# EAGLE design ThingShield_Proto (EAGLE 6.6.0)
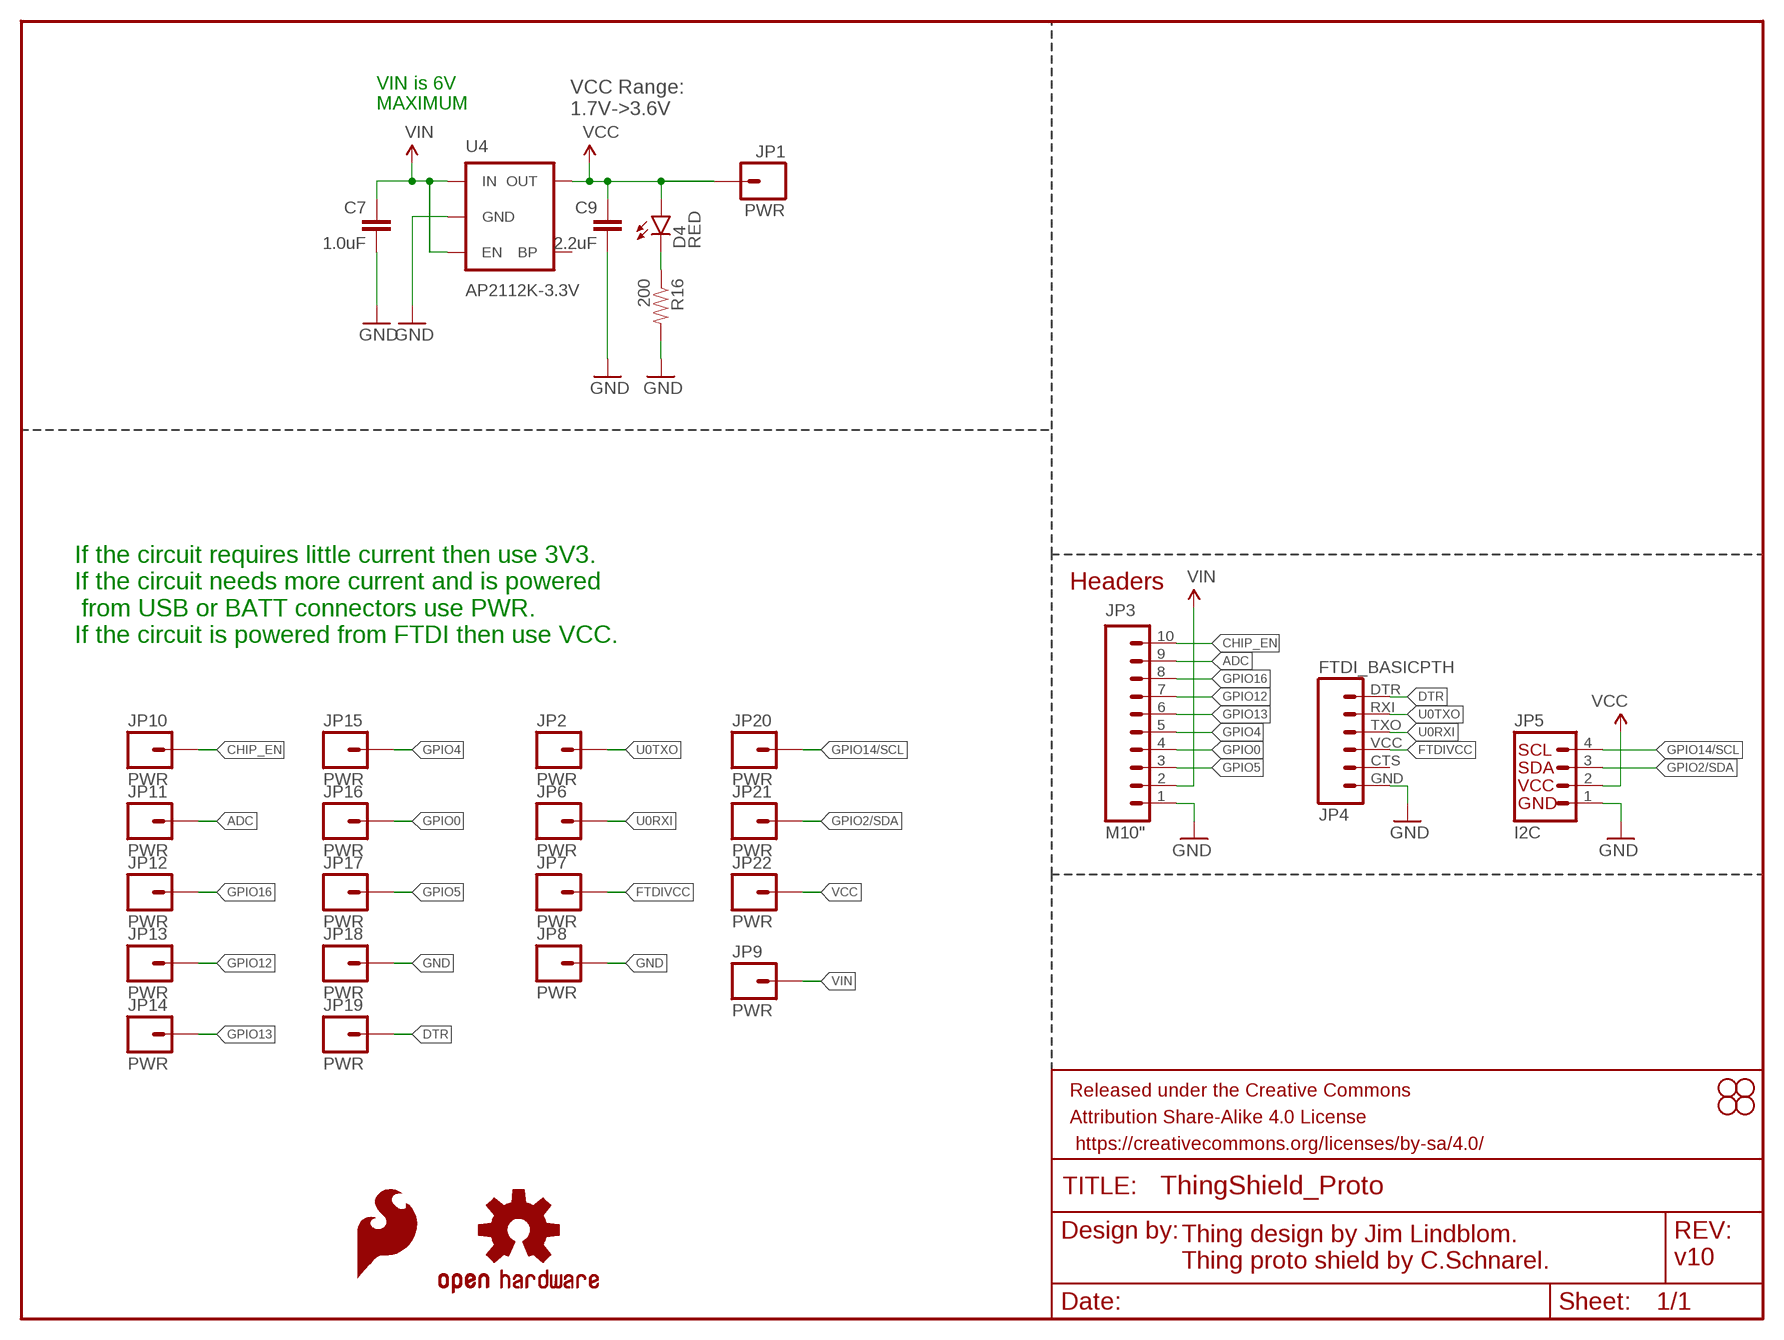
[diagram p0: schematic, sheet 1]

## Parts
C7  1.0uF  1.0UF-25V-+80/-20(0805)  [0805]
C9  2.2uF  2.2UF-10V-20%(0603)  [0603-CAP]
D4  RED  LED-RED0603  [LED-0603]
FRAME1  FRAME-LETTER  [CREATIVE_COMMONS]
JP1  PWR  M01PTH  [1X01]
JP2  PWR  M01PTH  [1X01]
JP3  M10"  [1X10]
JP4  FTDI_BASICPTH  [FTDI_BASIC]
JP5  I2C  I2C_STANDARD  [1X04]
JP6  PWR  M01PTH  [1X01]
JP7  PWR  M01PTH  [1X01]
JP8  PWR  M01PTH  [1X01]
JP9  PWR  M01PTH  [1X01]
JP10  PWR  M01PTH  [1X01]
JP11  PWR  M01PTH  [1X01]
JP12  PWR  M01PTH  [1X01]
JP13  PWR  M01PTH  [1X01]
JP14  PWR  M01PTH  [1X01]
JP15  PWR  M01PTH  [1X01]
JP16  PWR  M01PTH  [1X01]
JP17  PWR  M01PTH  [1X01]
JP18  PWR  M01PTH  [1X01]
JP19  PWR  M01PTH  [1X01]
JP20  PWR  M01PTH  [1X01]
JP21  PWR  M01PTH  [1X01]
JP22  PWR  M01PTH  [1X01]
LOGO3  SFE_LOGO_FLAME.1_INCH  [SFE_LOGO_FLAME_.1]
LOGO4  OSHW-LOGOS  [OSHW-LOGO-S]
R16  200  200OHM1/10W1%(0603)  [0603-RES]
STANDOFF1  STAND-OFF  [STAND-OFF]
STANDOFF2  STAND-OFF  [STAND-OFF]
STANDOFF3  STAND-OFF  [STAND-OFF]
STANDOFF4  STAND-OFF  [STAND-OFF]
U4  AP2112K-3.3V  V_REG_LDOSMD  [SOT23-5]

## Nets
ADC: JP3.9 JP11.1
CHIP_EN: JP3.10 JP10.1
DTR: JP4.DTR JP19.1
FTDIVCC: JP4.VCC JP7.1
GND: C7.2 C9.2 JP3.1 JP4.GND JP5.1 JP8.1 JP18.1 R16.2 U4.2(GND)
GPIO0: JP3.4 JP16.1
GPIO2/SDA: JP5.3 JP21.1
GPIO4: JP3.5 JP15.1
GPIO5: JP3.3 JP17.1
GPIO12: JP3.7 JP13.1
GPIO13: JP3.6 JP14.1
GPIO14/SCL: JP5.4 JP20.1
GPIO16: JP3.8 JP12.1
N$4: D4.C R16.1
PWR: C9.1 D4.A JP1.1 U4.5(OUT) ; supply symbol labelled VCC
U0RXI: JP4.TXO JP6.1
U0TXO: JP2.1 JP4.RXI
VCC: JP5.2 JP22.1
VIN: C7.1 JP3.2 JP9.1 U4.1(IN) U4.3(EN)
Unconnected: JP4.CTS U4.4(BP)

## Notes on the sheet
- VIN is 6V
  MAXIMUM
- VCC Range:
  1.7V->3.6V
- Headers
- If the circuit requires little current then use 3V3.
  If the circuit needs more current and is powered
   from USB or BATT connectors use PWR.
  If the circuit is powered from FTDI then use VCC.
- v10
- Thing design by Jim Lindblom. 
  Thing proto shield by C.Schnarel.

## Library data of the parts
C7 = SparkFun-Capacitors:1.0UF-25V-+80/-20(0805): CAP-11625; PROD_ID: CAP-11625
C9 = SparkFun-Capacitors:2.2UF-10V-20%(0603): CAP-07888; PROD_ID: CAP-07888
D4 = SparkFun-LED:LED-RED: Assorted Red LEDs LilyPad 1206- DIO-09912 1206- DIO-00809 0603- DIO-00819; PROD_ID: DIO-00819
FRAME1 = SparkFun-Aesthetics:FRAME-LETTER: Schematic Frame Standard 8.5x11 US Letter frame
JP1 JP2 JP6-JP22 = SparkFun-Connectors:M01: Header 1 Standard 1-pin 0.1" header. Use with straight break away headers (SKU : PRT-00116), right angle break away headers (PRT-00553), swiss pins (PRT-00743), machine pins (PRT-00117), and female headers (PRT-00115).
JP3 = SparkFun-Connectors:M10: Header 10 Standard 10-pin 0.1" header. Use with straight break away headers (SKU : PRT-00116), right angle break away headers (PRT-00553), swiss pins (PRT-00743), machine pins (PRT-00117), and female headers (PRT-00115).
JP4 = SparkFun-Connectors:FTDI_BASIC: FTDI Basic header with labels
JP5 = SparkFun-Connectors:I2C_STANDARD: SparkFun has standardized on a pinout for all I2C based sensor breakouts. This pinout allows I2C boards to be plugged directly into the headers on Arduino Uno compatible boards, and to be daisy chained easily.
LOGO3 = SparkFun-Aesthetics:SFE_LOGO_FLAME: SFE Logo, flame only This is the SparkFun flame logo. The logo on the schematic will always be the same size; the package variant is the height of the flame. Default layer for the logo on the board is tSilk.
LOGO4 = SparkFun-Aesthetics:OSHW-LOGO: Open Source Hardware Logo This logo indicates the piece of hardware it is found on incorporates a OSHW license and/or adheres to the definition of open source hardware found here: http://freedomdefined.org/OSHW
R16 = SparkFun-Resistors:200OHM1/10W1%(0603): RES-08220; PROD_ID: RES-08220
STANDOFF1-STANDOFF4 = SparkFun-Electromechanical:STAND-OFF: #4 Stand Off This is the mechanical footprint for a #4 phillips button head screw. Use the keepout ring to avoid running the screw head into surrounding components. SKU : PRT-00447
U4 = SparkFun-PowerIC:V_REG_LDO: Voltage Regulator LDO Standard 150mA LDO voltage regulator in SOT-23 layout. Micrel part MIC5205. BP (by-pass) pin is used to lower output noise with 470pF cap.; PROD_ID: VREG-12457

## Board
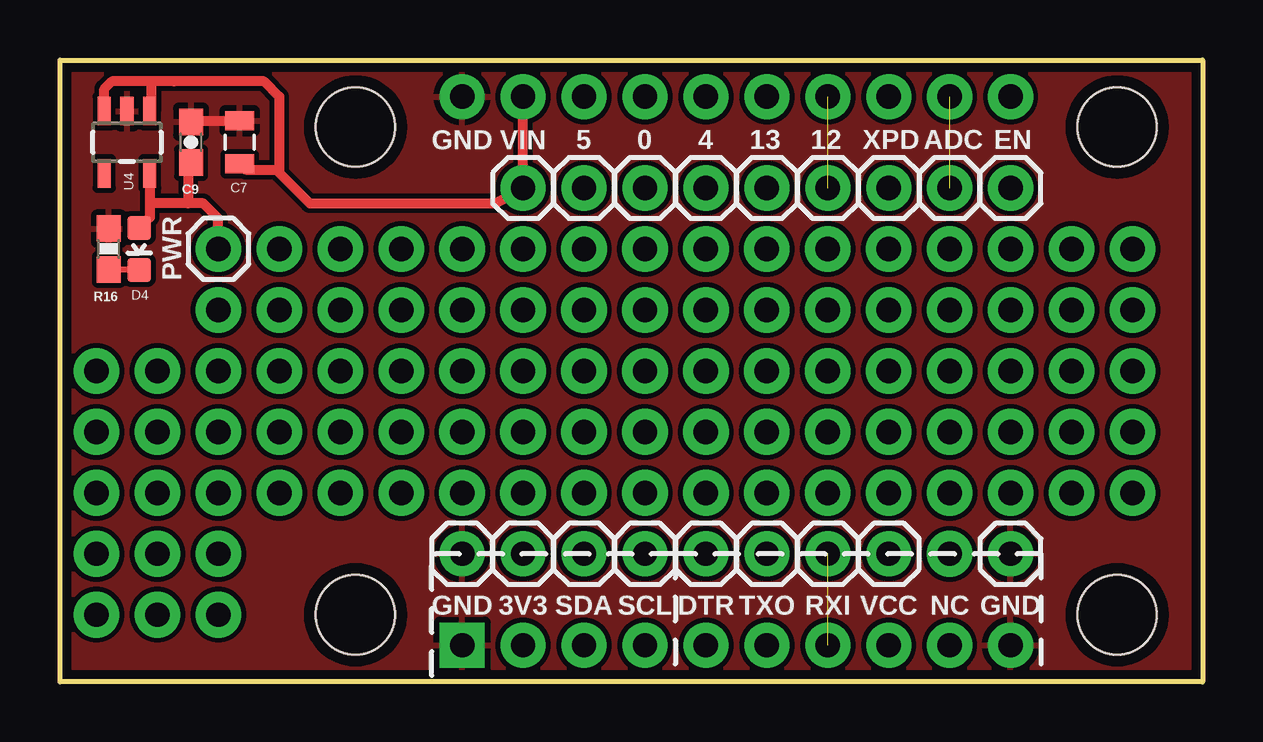
[diagram p1: board, top side]
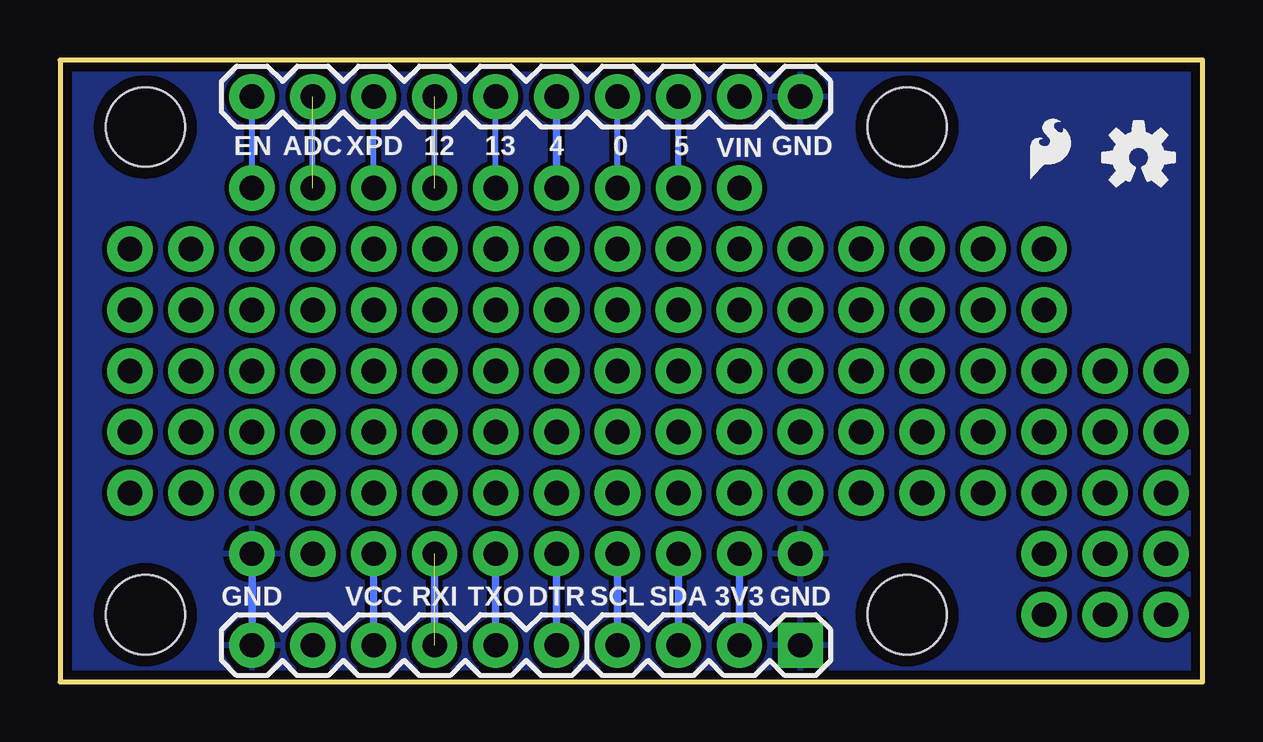
[diagram p2: board, bottom side, seen from below]

Size 47.62 x 25.91 mm. Coordinates in mm from the lower left corner, seen from the top.
Outline: 0,0 0,25.91 47.62,25.91 47.62,0 0,0
Copper layers (1*16): Top 0.0356mm / dielectric 1.5011mm / Bottom 0.0356mm
Design rules "LaenPCBOrder": minimum track width 6mil, minimum drill 13mil, track to track 6mil, track to pad 6mil, pad to pad 6mil, via to via 6mil, smd to smd 6mil, copper to edge 15mil, drill to drill 6mil, minimum pad ring 7mil, minimum via ring 7mil, stop-mask expansion 4mil, vias tented up to drill 0mil, thermal gap 10mil
tRestrict: 2 lines

### Footprints (pad centres in the part's own frame; a part is rotated, then mirrored left to right if it is on the bottom)
0805 = smd 0.8 x 1.2: 1 -0.9,0; 2 0.9,0
0603-CAP = smd 1.1 x 1: 1 -0.85,0; 2 0.85,0
LED-0603 = smd 1 x 1: A 0,-0.877; C 0,0.877
1X01 = drill 1.016 pad 1.88: 1 0,0
1X10 = drill 1.016 pad 1.88: 1 0,0; 2 2.54,0; 3 5.08,0; 4 7.62,0; 5 10.16,0; 6 12.7,0; 7 15.24,0; 8 17.78,0; 9 20.32,0; 10 22.86,0
FTDI_BASIC = drill 1.016 pad 1.88: CTS 10.16,0; DTR 0,0; GND 12.7,0; RXI 2.54,0; TXO 5.08,0; VCC 7.62,0
1X04 = drill 1.016 pad 1.88 square: 1 0,0 | drill 1.016 pad 1.88: 2 2.54,0; 3 5.08,0; 4 7.62,0
0603-RES = smd 1.1 x 1: 1 -0.85,0; 2 0.85,0
STAND-OFF = hole 3.302: 0,0
SOT23-5 = smd 0.55 x 1.2: 1 -0.95,-1.3; 2 0,-1.3; 3 0.95,-1.3; 4 0.95,1.3; 5 -0.95,1.3

### Placement (x,y rotation side)
C7  7.49,22.48 90 top
C9  5.46,22.48 90 top
D4  3.3,18.03 180 top
FRAME1  -1.78,-18.29 0 top  (outside the outline)
JP1  6.6,18.03 0 top
JP2  29.46,5.33 0 top
JP3  16.76,24.38 180 bottom
JP4  26.92,1.52 180 bottom
JP5  16.76,1.52 180 bottom
JP6  32,5.33 0 top
JP7  34.54,5.33 0 top
JP8  16.76,5.33 0 top
JP9  19.3,20.57 0 top
JP10  39.62,20.57 0 top
JP11  37.08,20.57 0 top
JP12  34.54,20.57 0 top
JP13  32,20.57 0 top
JP14  29.46,20.57 0 top
JP15  26.92,20.57 0 top
JP16  24.38,20.57 0 top
JP17  21.84,20.57 0 top
JP18  39.62,5.33 0 top
JP19  26.92,5.33 0 top
JP20  24.38,5.33 0 top
JP21  21.84,5.33 0 top
JP22  19.3,5.33 0 top
LOGO3  7.49,20.57 0 bottom
LOGO4  2.67,21.84 0 bottom
R16  2.03,18.03 90 top
STANDOFF1  44.07,23.11 0 top
STANDOFF2  44.07,2.79 0 top
STANDOFF3  12.32,23.11 0 top
STANDOFF4  12.32,2.79 0 top
U4  2.79,22.48 180 top

### Tracks (layer width: path | path; a pad name or v marks a point on that pad's centre or on a via)
ADC  (1 unrouted)
CHIP_EN
  Bottom 0.254: JP10.1 JP3.10
DTR
  Bottom 0.305: JP4.DTR JP19.1
FTDIVCC
  Bottom 0.305: JP4.VCC JP7.1
GND
  Top 0.406: C9.2 5.51,23.38 C7.2
  Bottom 0.305: JP4.GND JP18.1
  pour Top (isolate 0.203, rank 6): 0,25.91 0,0 47.62,0 47.62,25.91
  pour Bottom (isolate 0.203): 0,25.91 0,0 47.62,0 47.62,25.91
GPIO0
  Bottom 0.254: JP16.1 JP3.4
GPIO2/SDA
  Bottom 0.305: JP5.3 JP21.1
GPIO4
  Bottom 0.305: JP15.1 JP3.5
GPIO5
  Bottom 0.254: JP17.1 JP3.3
GPIO12  (1 unrouted)
GPIO13
  Bottom 0.254: JP14.1 JP3.6
GPIO14/SCL
  Bottom 0.305: JP5.4 JP20.1
GPIO16
  Bottom 0.254: JP12.1 JP3.8
N$4
  Top 0.254: R16.1 3.27,17.18 D4.C
N$6  (via drill 1.02 pad 1.91)
  other vias: 24.38,18.03
N$7  (via drill 1.02 pad 1.91)
  other vias: 29.46,18.03
N$8  (via drill 1.02 pad 1.91)
  other vias: 34.54,18.03
N$9  (via drill 1.02 pad 1.91)
  other vias: 39.62,18.03
N$10  (via drill 1.02 pad 1.91)
  other vias: 42.16,18.03
N$11  (via drill 1.02 pad 1.91)
  other vias: 44.7,18.03
N$12  (via drill 1.02 pad 1.91)
  other vias: 14.22,18.03
N$13  (via drill 1.02 pad 1.91)
  other vias: 16.76,18.03
N$14  (via drill 1.02 pad 1.91)
  other vias: 9.14,18.03
N$15  (via drill 1.02 pad 1.91)
  other vias: 24.38,15.49
N$16  (via drill 1.02 pad 1.91)
  other vias: 29.46,15.49
N$17  (via drill 1.02 pad 1.91)
  other vias: 34.54,15.49
N$18  (via drill 1.02 pad 1.91)
  other vias: 39.62,15.49
N$19  (via drill 1.02 pad 1.91)
  other vias: 42.16,15.49
N$20  (via drill 1.02 pad 1.91)
  other vias: 44.7,15.49
N$21  (via drill 1.02 pad 1.91)
  other vias: 14.22,15.49
N$22  (via drill 1.02 pad 1.91)
  other vias: 16.76,15.49
N$23  (via drill 1.02 pad 1.91)
  other vias: 9.14,15.49
N$24  (via drill 1.02 pad 1.91)
  other vias: 24.38,12.95
N$25  (via drill 1.02 pad 1.91)
  other vias: 29.46,12.95
N$26  (via drill 1.02 pad 1.91)
  other vias: 34.54,12.95
N$27  (via drill 1.02 pad 1.91)
  other vias: 39.62,12.95
N$28  (via drill 1.02 pad 1.91)
  other vias: 42.16,12.95
N$29  (via drill 1.02 pad 1.91)
  other vias: 44.7,12.95
N$30  (via drill 1.02 pad 1.91)
  other vias: 14.22,12.95
N$31  (via drill 1.02 pad 1.91)
  other vias: 16.76,12.95
N$32  (via drill 1.02 pad 1.91)
  other vias: 9.14,12.95
N$33  (via drill 1.02 pad 1.91)
  other vias: 4.06,10.41
N$34  (via drill 1.02 pad 1.91)
  other vias: 24.38,10.41
N$35  (via drill 1.02 pad 1.91)
  other vias: 29.46,10.41
N$36  (via drill 1.02 pad 1.91)
  other vias: 34.54,10.41
N$37  (via drill 1.02 pad 1.91)
  other vias: 39.62,10.41
N$38  (via drill 1.02 pad 1.91)
  other vias: 42.16,10.41
N$39  (via drill 1.02 pad 1.91)
  other vias: 44.7,10.41
N$40  (via drill 1.02 pad 1.91)
  other vias: 14.22,10.41
N$41  (via drill 1.02 pad 1.91)
  other vias: 16.76,10.41
N$42  (via drill 1.02 pad 1.91)
  other vias: 9.14,10.41
N$43  (via drill 1.02 pad 1.91)
  other vias: 4.06,7.87
N$44  (via drill 1.02 pad 1.91)
  other vias: 24.38,7.87
N$45  (via drill 1.02 pad 1.91)
  other vias: 29.46,7.87
N$46  (via drill 1.02 pad 1.91)
  other vias: 34.54,7.87
N$47  (via drill 1.02 pad 1.91)
  other vias: 39.62,7.87
N$48  (via drill 1.02 pad 1.91)
  other vias: 42.16,7.87
N$49  (via drill 1.02 pad 1.91)
  other vias: 44.7,7.87
N$50  (via drill 1.02 pad 1.91)
  other vias: 14.22,7.87
N$51  (via drill 1.02 pad 1.91)
  other vias: 16.76,7.87
N$52  (via drill 1.02 pad 1.91)
  other vias: 9.14,7.87
N$53  (via drill 1.02 pad 1.91)
  other vias: 4.06,5.33
N$56
  Bottom 0.305: 32,1.52 32,5.33
N$58  (via drill 1.02 pad 1.91)
  other vias: 1.52,2.79
N$59  (via drill 1.02 pad 1.91)
  other vias: 4.06,2.79
N$60  (via drill 1.02 pad 1.91)
  other vias: 6.6,2.79
N$66
  Bottom 0.254: 32,20.57 32,24.38
N$67
  Bottom 0.254: 37.08,20.57 37.08,24.38
N$69  (via drill 1.02 pad 1.91)
  other vias: 6.6,5.33
N$70  (via drill 1.02 pad 1.91)
  other vias: 1.52,5.33
N$71  (via drill 1.02 pad 1.91)
  other vias: 1.52,7.87
N$72  (via drill 1.02 pad 1.91)
  other vias: 6.6,7.87
N$73  (via drill 1.02 pad 1.91)
  other vias: 11.68,7.87
N$74  (via drill 1.02 pad 1.91)
  other vias: 11.68,10.41
N$75  (via drill 1.02 pad 1.91)
  other vias: 6.6,10.41
N$76  (via drill 1.02 pad 1.91)
  other vias: 6.6,12.95
N$77  (via drill 1.02 pad 1.91)
  other vias: 4.06,12.95
N$78  (via drill 1.02 pad 1.91)
  other vias: 1.52,12.95
N$79  (via drill 1.02 pad 1.91)
  other vias: 1.52,10.41
N$80  (via drill 1.02 pad 1.91)
  other vias: 6.6,15.49
N$81  (via drill 1.02 pad 1.91)
  other vias: 11.68,18.03
N$82  (via drill 1.02 pad 1.91)
  other vias: 11.68,15.49
N$83  (via drill 1.02 pad 1.91)
  other vias: 11.68,12.95
N$84  (via drill 1.02 pad 1.91)
  other vias: 19.3,18.03
N$85  (via drill 1.02 pad 1.91)
  other vias: 19.3,15.49
N$86  (via drill 1.02 pad 1.91)
  other vias: 19.3,12.95
N$87  (via drill 1.02 pad 1.91)
  other vias: 19.3,10.41
N$88  (via drill 1.02 pad 1.91)
  other vias: 19.3,7.87
N$90  (via drill 1.02 pad 1.91)
  other vias: 21.84,7.87
N$91  (via drill 1.02 pad 1.91)
  other vias: 21.84,10.41
N$92  (via drill 1.02 pad 1.91)
  other vias: 21.84,12.95
N$93  (via drill 1.02 pad 1.91)
  other vias: 21.84,15.49
N$94  (via drill 1.02 pad 1.91)
  other vias: 21.84,18.03
N$95  (via drill 1.02 pad 1.91)
  other vias: 26.92,18.03
N$96  (via drill 1.02 pad 1.91)
  other vias: 26.92,15.49
N$97  (via drill 1.02 pad 1.91)
  other vias: 26.92,12.95
N$98  (via drill 1.02 pad 1.91)
  other vias: 26.92,10.41
N$99  (via drill 1.02 pad 1.91)
  other vias: 26.92,7.87
N$101  (via drill 1.02 pad 1.91)
  other vias: 32,7.87
N$102  (via drill 1.02 pad 1.91)
  other vias: 32,10.41
N$103  (via drill 1.02 pad 1.91)
  other vias: 32,12.95
N$104  (via drill 1.02 pad 1.91)
  other vias: 32,15.49
N$105  (via drill 1.02 pad 1.91)
  other vias: 32,18.03
N$106  (via drill 1.02 pad 1.91)
  other vias: 37.08,18.03
N$107  (via drill 1.02 pad 1.91)
  other vias: 37.08,15.49
N$108  (via drill 1.02 pad 1.91)
  other vias: 37.08,12.95
N$109  (via drill 1.02 pad 1.91)
  other vias: 37.08,10.41
N$110  (via drill 1.02 pad 1.91)
  other vias: 37.08,7.87
N$111  (via drill 1.02 pad 1.91)
  other vias: 37.08,5.33
PWR
  Top 0.406: U4.5 3.74,19.94 | 3.74,19.94 3.74,19.35 D4.A | 5.33,19.94 5.97,19.94 6.6,19.3 JP1.1 | 5.33,19.94 3.74,19.94 | C9.1 5.33,21.5 5.33,19.94
U0RXI  (1 unrouted)
U0TXO
  Bottom 0.305: JP4.RXI JP2.1
VCC
  Bottom 0.305: JP5.2 JP22.1
VIN
  Top 0.406: 3.81,25.03 4.75,25.02 8.51,25.02 9.14,24.38 9.14,21.34 | 3.81,25.03 2.16,25.02 1.84,24.7 U4.3 | 9.14,21.34 9.14,21.21 10.41,19.94 18.16,19.94 JP9.1 JP3.2 | U4.1 3.81,23.85 3.81,25.03 | C7.1 7.74,21.34 9.14,21.34

### Text on the board
tPlace: GND | VIN | 5 | 0 | 4 | 13 | 12 | XPD | ADC | EN | PWR | GND | 3V3 | SDA | SCL | DTR | TXO | RXI | VCC | NC | GND
bPlace: GND | VIN | 5 | 0 | 4 | 13 | 12 | XPD | ADC | EN | GND | 3V3 | SDA | SCL | DTR | TXO | RXI | VCC | GND
tDocu: If the circuit requires little current then use 3V3. / If the circuit needs more current and is powered from USB or BATT connectors use PWR. / If the circuit is powered from FTDI then use VCC. | Jim Lindblom